# EasyEDA Pro project STC32F12K54_Motherboard_V1.epro

# Board PCB1
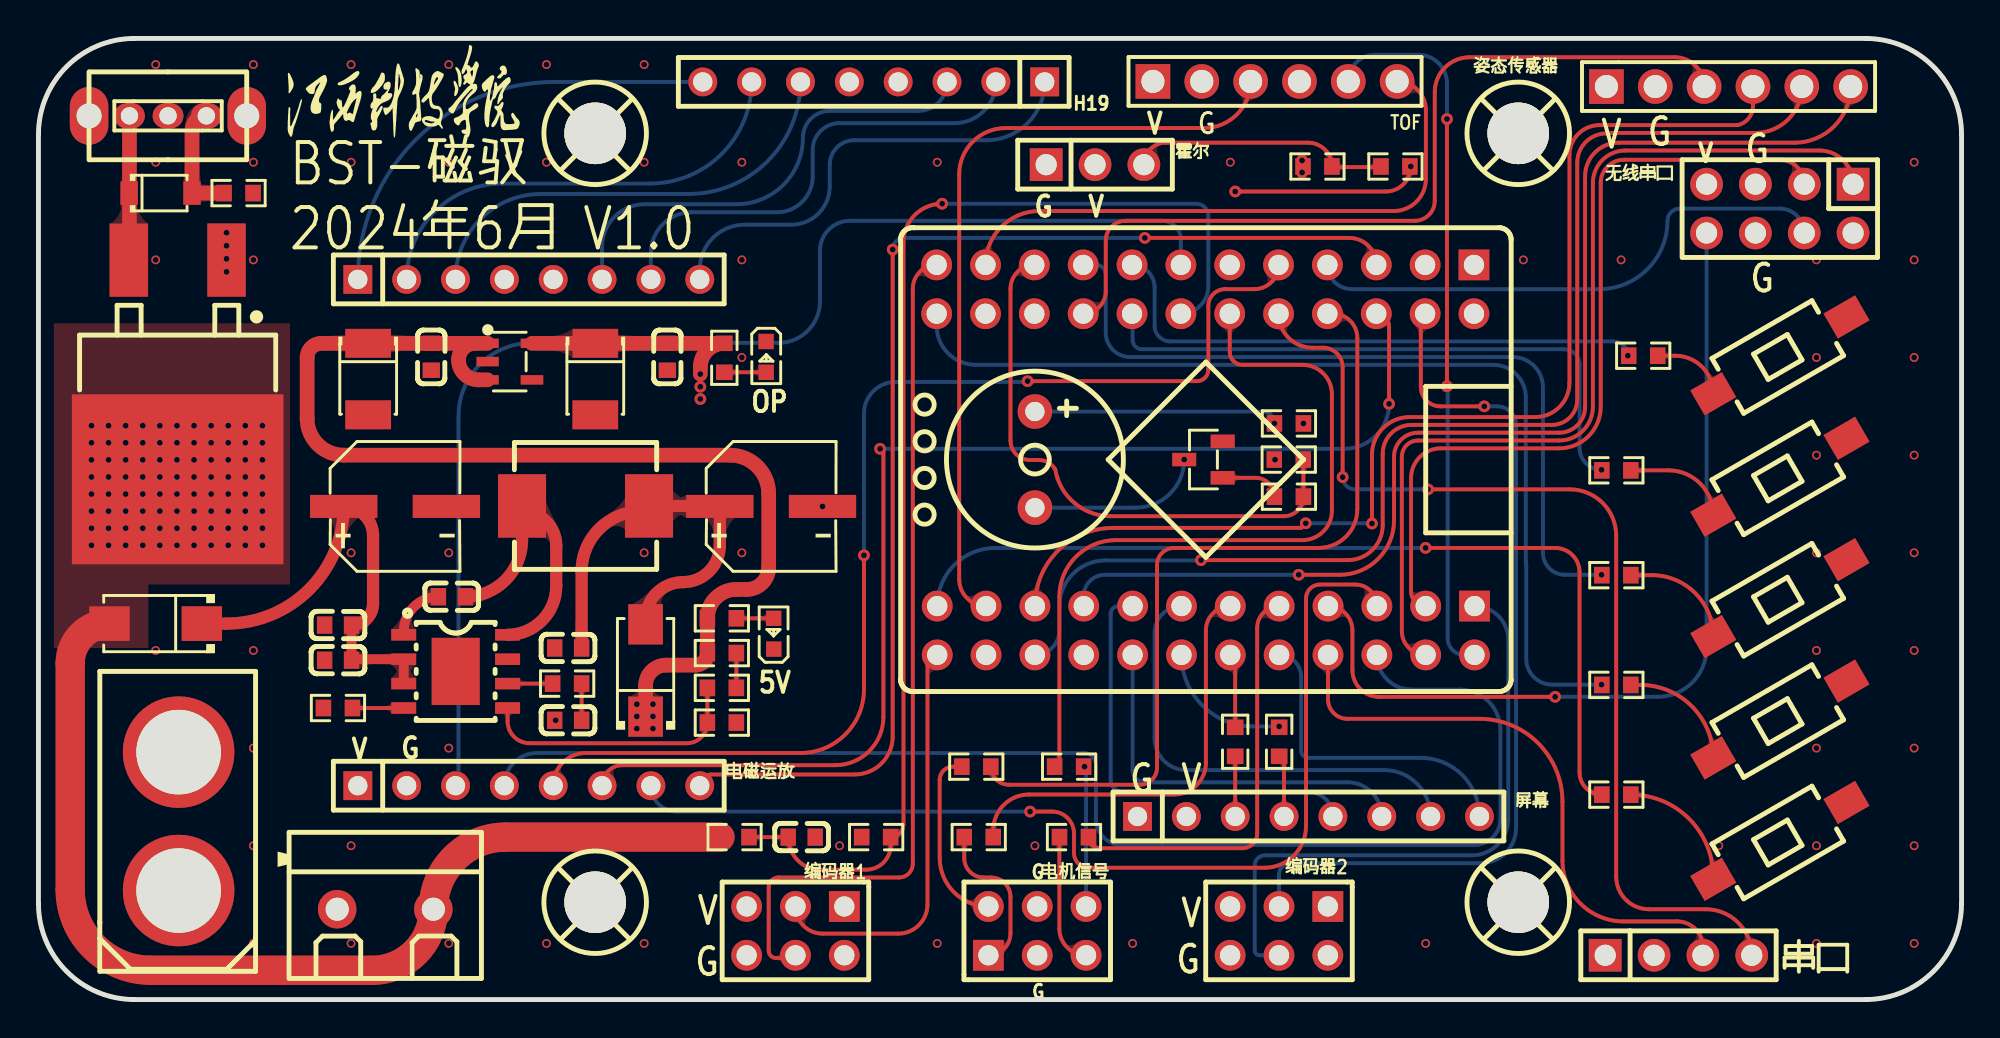
[diagram p0: board, top side]
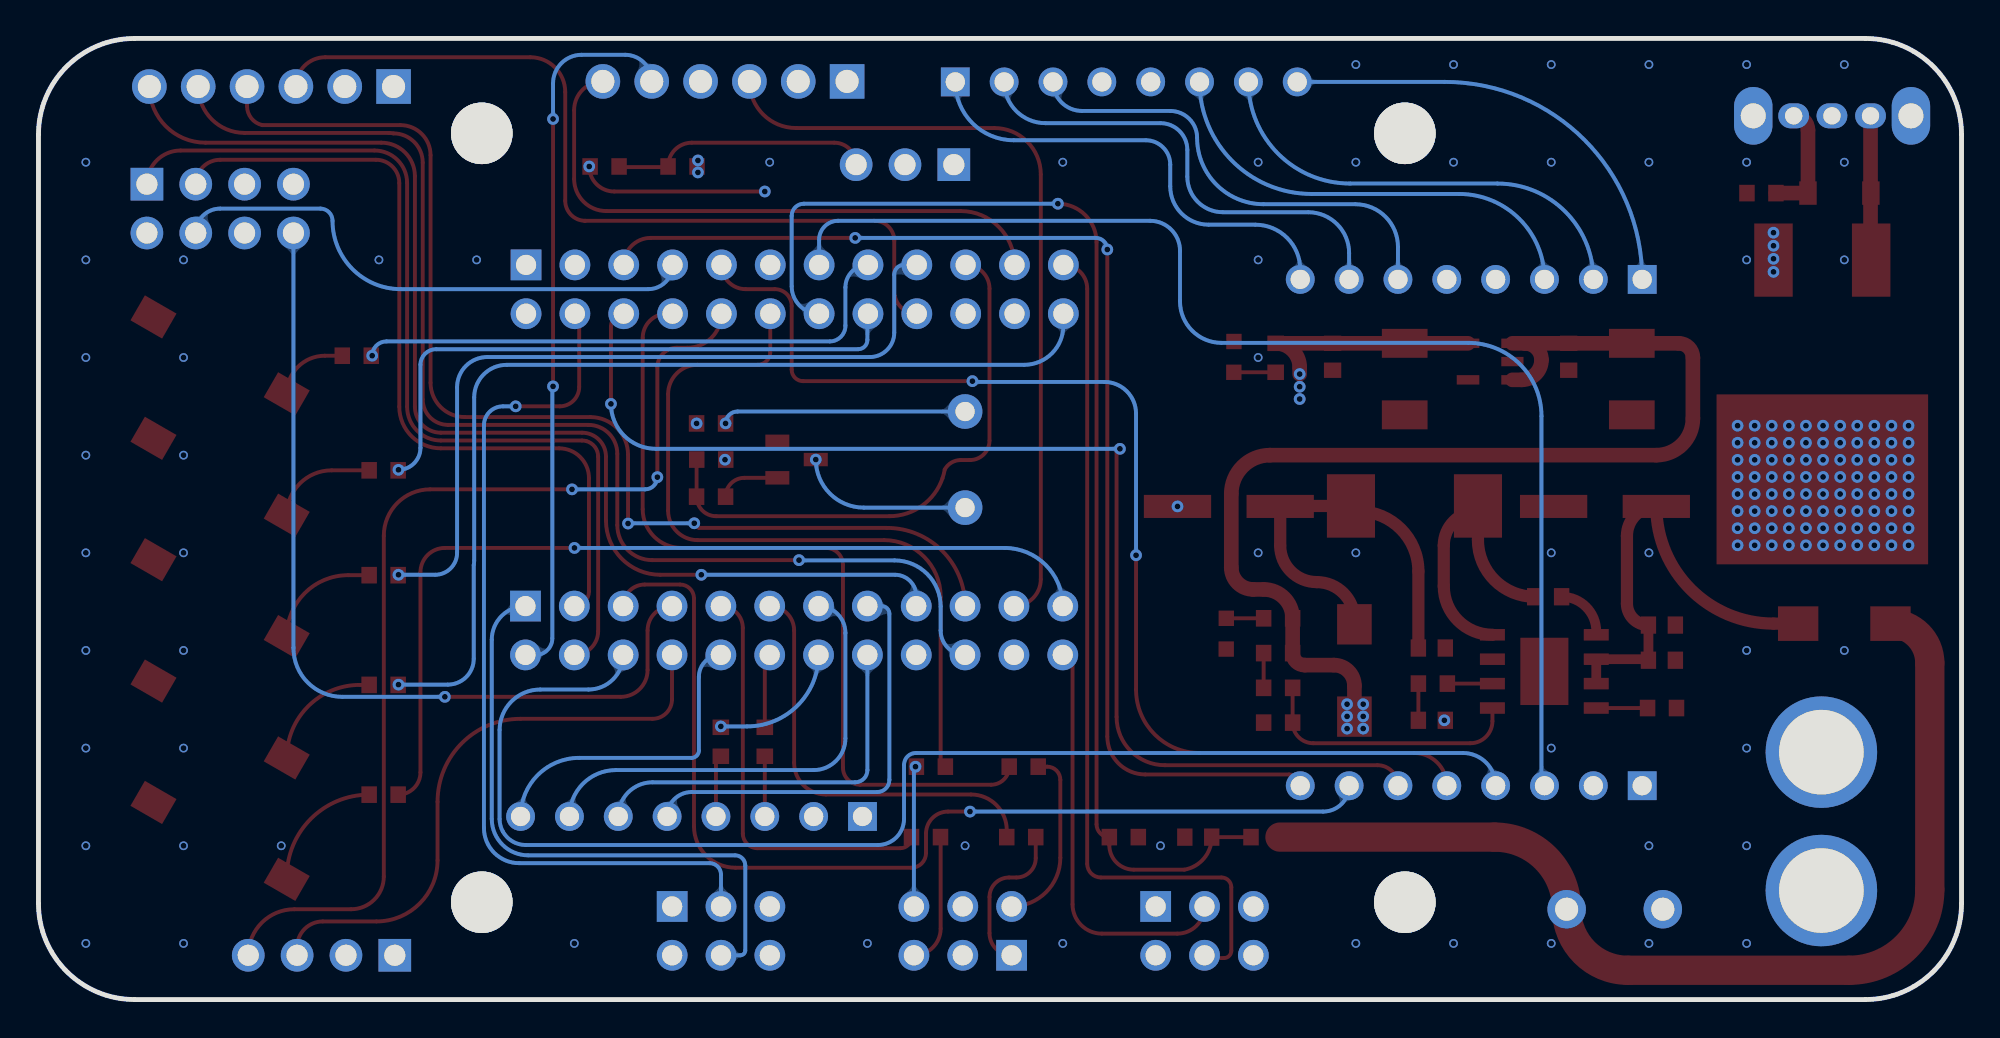
[diagram p1: board, bottom side, seen from below]

Outline 100 x 50 mm; copper layers: Top Layer, Inner1, Inner2, Bottom Layer. Coordinates in mm from the lower left corner of the outline.
Outline path: 0,45 0,5 arc(1.46,1.46) 5,0 95,0 arc(98.54,1.46) 100,5 100,45 arc(98.54,48.54) 95,50 5,50 arc(1.46,48.54) 0,45
Stack: Top Layer 0.035mm 外层铜厚1oz / Dielectric1 0.2104mm 7628 RC49% 8.6mil / Inner1 0.0152mm 内层铜厚 / Dielectric2 1.065mm 1.1mm H/HOZ 含铜 / Inner2 0.0152mm 内层铜厚 / Dielectric3 0.2104mm 7628 RC49% 8.6mil / Bottom Layer 0.035mm 外层铜厚1oz

## Design rules (mm)
template: 自定义配置
spacing copperThickness1oz (default): track to track 0.203, other pairs 0.152 to 0.3
spacing copperThickness2oz: track to track 0.203, other pairs 0.152 to 0.3
track width copperThickness1oz (default): min 0.127, default 0.203, max 2.54
track width copperThickness2oz: min 0.203, default 0.254, max 2.54
track width VCC5V: min 0.127, default 0.762, max 2.54
track width VCCBAT: min 0.127, default 1.524, max 2.54
differential pair differentialPair (default): width min 0.127, default 0.254, max 2.54; gap min 0.152, default 0.152
via viaSize (default): diameter min 0.457, default 0.457, max 10; hole min 0.3, default 0.305, max 6.299
net +5V uses VCC5V
net VCCBAT uses VCCBAT
net VCCOP uses VCC5V

## Placement (name value [footprint] x y rotation side)
BUZ1  蜂鸣器  [BUZ-TH_BD9.0-P5.00-D0.6-FD]  51.82 28.09 270 top
C9  4.7uF  [C0603]  15.58 19.48 0 top
C10  100nF  [C0603]  15.58 17.65 0 top
C11  100nF  [C0603]  21.5 20.95 0 top
C12  47uF  [C0603]  27.54 18.29 0 top
C14  4.7nF  [C0603]  27.54 14.53 0 top
C15  100nF  [C0603]  39.69 8.45 0 top
C17  100nF  [C0603]  20.43 33.44 90 top
C19  100nF  [C0603]  32.7 33.44 90 top
C20  100uF  [CASE-B_3528]  17.14 32.28 270 top
C21  100uF  [CASE-B_3528]  28.96 32.28 270 top
D2  BZT52C16  [sod-123_l2.7-w1.6-ls3.7-rd]  6.35 41.95 0 top
H6  -  [HDR-TH_4P-P2.54-V-M]  85.28 2.3 0 top
H9  -  [HDR-TH_6P-P2.54-V-R2-C3-S2.54_A2541WV-2X3P]  39.37 3.57 180 top
H10  -  [HDR-TH_6P-P2.54-V-R2-C3-S2.54_A2541WV-2X3P]  64.51 3.57 180 top
H11  -  [HDR-TH_8P-P2.54-V-M-R2-C4-S2.54]  90.55 41.15 180 top
H13  -  [HDR-TH_6P-P2.54-V-M-1]  64.3 47.76 0 top
H14  -  [HDR-TH_8P-P2.54-V-M]  66.04 9.53 0 top
H15  -  [HDR-TH_3P-P2.54-V-M]  54.94 43.43 0 top
H16  -  [HDR-TH_6P-P2.54-V-M-1]  87.88 47.5 0 top
H17  -  [HDR-TH_6P-P2.54-V-R2-C3-S2.54_A2541WV-2X3P]  51.94 3.57 0 top
H18  -  [HDR-TH_8P-P2.54-V-M]  25.5 11.13 0 top
H19  -  [HDR-TH_8P-P2.54-V-M]  43.43 47.74 180 top
H20  -  [HDR-TH_8P-P2.54-V-M]  25.5 37.47 0 top
LED4  -  [LED_0603]  37.85 33.38 270 top
LED5V  -  [LED_0603]  38.23 19.08 90 top
P1  KF301-2P接线端子  [CONN-TH_XY301V-A-5.0-2P]  18.03 4.7 180 top
Q2  HY19P03B  [TO-263-2_L10.2-W8.7-P5.08-LS15.1-BR]  7.24 32.77 90 top
Q3  SS8050  [SOT-23-3_L2.9-W1.3-P1.90-LS2.4-BR]  60.58 28.09 0 top
R1  10K  [R0603]  10.41 41.95 180 top
R8  200K  [R0603]  15.57 15.17 0 top
R9  51K  [R0603]  35.54 18.02 180 top
R10  1.5K  [R0603]  35.54 16.22 0 top
R11  10K  [R0603]  35.54 14.41 180 top
R12  4.7K  [R0603]  35.54 19.83 180 top
R13  20K  [R0603]  27.49 16.44 180 top
R15  200K  [R0603]  36.19 8.45 0 top
R16  20K  [R0603]  43.56 8.45 180 top
R17  100R  [R0603]  62.23 13.41 270 top
R18  100R  [R0603]  64.52 13.41 270 top
R19  100R  [R0603]  82.05 16.37 0 top
R20  100R  [R0603]  82.05 10.66 0 top
R21  100R  [R0603]  83.45 33.49 0 top
R22  100R  [R0603]  82.05 27.53 0 top
R23  100R  [R0603]  82.05 22.08 0 top
R24  10R  [R0603]  65.02 29.97 180 top
R25  4.7K  [R0603]  65.02 26.16 180 top
R26  10K  [R0603]  65.02 28.09 180 top
R31  10K  [R0603]  70.56 43.34 180 top
R32  10K  [R0603]  66.51 43.34 0 top
R33  10K  [R0603]  48.77 12.12 180 top
R34  10K  [R0603]  48.9 8.45 180 top
R35  10K  [R0603]  53.85 8.45 0 top
R36  10K  [R0603]  53.59 12.12 180 top
R37  2.7K  [R0603]  35.67 33.39 270 top
SCREW1  -  [M3螺丝]  29.01 5 0 top
SCREW2  -  [M3螺丝]  77.01 5 0 top
SCREW3  -  [M3螺丝]  29.01 45 0 top
SCREW4  -  [M3螺丝]  77.01 45 0 top
SW2  -  [SW-TH_SS-12D02-VG4]  6.73 45.97 180 top
SW3  TS-1096S-A2B3-C1D2  [SW-SMD_L6.0-W3.3-LS8.0]  90.55 14.57 30 top
SW4  TS-1096S-A2B3-C1D2  [SW-SMD_L6.0-W3.3-LS8.0]  90.55 8.25 30 top
SW5  TS-1096S-A2B3-C1D2  [SW-SMD_L6.0-W3.3-LS8.0]  90.55 33.51 30 top
SW6  TS-1096S-A2B3-C1D2  [SW-SMD_L6.0-W3.3-LS8.0]  90.55 27.2 30 top
SW7  TS-1096S-A2B3-C1D2  [SW-SMD_L6.0-W3.3-LS8.0]  90.55 20.88 30 top
U11  XT60  [CONN-TH_XT60]  7.29 9.27 90 top
U13  SP1N28STER  [ESOP-8_L4.9-W3.9-P1.27-LS6.0-TL-EP]  21.69 17.07 0 top
U14  -  [逐飞STC32F12-48P核心板]  60.71 28.09 270 top
U15  SS54  [SMA_L4.2-W2.6-LS5.1-RD]  6.1 19.56 180 top
U16  SS54  [SMA_L4.2-W2.6-LS5.1-RD]  31.57 17.12 90 top
U17  RT9013-18GB  [SOT-23-5_L3.0-W1.7-P0.95-LS2.8-BL]  24.51 33.19 270 top
U19  Inductor,47UH/功率电感  [IND-SMD_L7.4-W6.6]  28.45 25.68 0 top
U20  100uF贴片电解  [CAP-SMD_BD6.3-L6.6-W6.6-LS7.4-FD]  18.54 25.65 0 top
U21  100uF贴片电解  [CAP-SMD_BD6.3-L6.6-W6.6-LS7.4-FD]  38.1 25.65 0 top

## Footprints (pads in the part's own frame, mm; a bottom-side part is the same pattern mirrored in y, then rotated)
BUZ-TH_BD9.0-P5.00-D0.6-FD
  round 1.8 hole 1: 1(-2.5,0) 2(2.5,0)
C0603
  rect 0.8x0.9 smd: 1(-0.7,0) 2(0.7,0)
CAP-SMD_BD6.3-L6.6-W6.6-LS7.4-FD
  rect 3.5x1.2 smd: 1(-2.67,0) 2(2.67,0)
CASE-B_3528
  rect 1.506x2.376 smd: 1(-1.861,0) 2(1.861,0)
CONN-TH_XT60
  round 5.8 hole 4.4: 1(-3.6,0) 2(3.6,0)
CONN-TH_XY301V-A-5.0-2P
  round 2 hole 1.2: 1(-2.5,0) 2(2.5,0)
ESOP-8_L4.9-W3.9-P1.27-LS6.0-TL-EP
  rect 1.3x0.6 smd: 1(-2.7,1.905) 2(-2.7,0.635) 3(-2.7,-0.635) 4(-2.7,-1.905) 5(2.7,-1.905) 6(2.7,-0.635) 7(2.7,0.635) 8(2.7,1.905)
  rect 2.5x3.5 smd: 9(0,0)
HDR-TH_3P-P2.54-V-M
  rect 1.7x1.7 hole 1.1: 1(-2.54,0)
  round 1.7 hole 1.1: 2(0,0) 3(2.54,0)
HDR-TH_4P-P2.54-V-M
  rect 1.7x1.7 hole 1.1: 1(-3.81,0)
  round 1.7 hole 1.1: 2(-1.27,0) 3(1.27,0) 4(3.81,0)
HDR-TH_6P-P2.54-V-M-1
  rect 1.8x1.8 hole 1.2: 1(-6.35,0)
  round 1.8 hole 1.2: 2(-3.81,0) 3(-1.27,0) 4(1.27,0) 5(3.81,0) 6(6.35,0)
HDR-TH_6P-P2.54-V-R2-C3-S2.54_A2541WV-2X3P
  rect 1.6x1.6 hole 1.05: 1(-2.54,-1.27)
  round 1.6 hole 1.05: 2(-2.54,1.27) 3(0,-1.27) 4(0,1.27) 5(2.54,-1.27) 6(2.54,1.27)
HDR-TH_8P-P2.54-V-M
  rect 1.5x1.5 hole 1: 1(-8.89,0)
  round 1.5 hole 1: 2(-6.35,0) 3(-3.81,0) 4(-1.27,0) 5(1.27,0) 6(3.81,0) 7(6.35,0) 8(8.89,0)
HDR-TH_8P-P2.54-V-M-R2-C4-S2.54
  rect 1.7x1.7 hole 1.1: 1(-3.81,-1.27)
  round 1.7 hole 1.1: 2(-3.81,1.27) 3(-1.27,-1.27) 4(-1.27,1.27) 5(1.27,-1.27) 6(1.27,1.27) 7(3.81,-1.27) 8(3.81,1.27)
IND-SMD_L7.4-W6.6
  rect 2.5x3.3 smd: 1(-3.302,0) 2(3.302,0)
LED_0603
  rect 0.8x0.8 smd: 1(-0.851,-0.01) 2(0.75,-0.005)
M3螺丝
  round 3.2 hole 3.2: 1(-0.064,0.064)
R0603
  rect 0.806x0.864 smd: 1(-0.753,0) 2(0.753,0)
SMA_L4.2-W2.6-LS5.1-RD
  rect 2.1x1.8 smd: 1(-2.4,0) 2(2.4,0)
sod-123_l2.7-w1.6-ls3.7-rd
  rect 0.91x1.22 smd: 1(-1.635,0) 2(1.635,0)
SOT-23-3_L2.9-W1.3-P1.90-LS2.4-BR
  rect 1.25x0.7 smd: 1(1,-0.95) 2(1,0.95) 3(-1,0)
SOT-23-5_L3.0-W1.7-P0.95-LS2.8-BL
  rect 0.49x1.157 smd: 1(-0.95,-1.153) 2(0,-1.153) 3(0.95,-1.153)
  rect 0.49x1.175 smd: 4(0.95,1.153) 5(-0.95,1.153)
SW-SMD_L6.0-W3.3-LS8.0
  rect 1.9x1.5 smd: 1(-4,0) 2(4,0)
SW-TH_SS-12D02-VG4
  oval 1.6x1.3 hole 0.899: 1(-1.999,0) 2(-0.007,0) 3(1.999,0)
  oval 1.999x2.999 hole 1.3: 4(4.099,0) 5(-4.099,0)
TO-263-2_L10.2-W8.7-P5.08-LS15.1-BR
  rect 3.81x2 smd: 1(5.704,-2.54) 3(5.704,2.54)
  rect 8.84x11 smd: 4(-5.704,0)
逐飞STC32F12-48P核心板
  rect 1.6x1.6 hole 1.05: 1(-10.13,13.94) 47(7.62,13.97)
  round 1.6 hole 1.05: 2(-7.59,13.94) 3(-10.13,11.4) 4(-7.59,11.4) 5(-10.13,8.86) 6(-7.59,8.86) 7(-10.13,6.32) 8(-7.59,6.32) 9(-10.13,3.78) 10(-7.59,3.78) 11(-10.13,1.24) 12(-7.59,1.24) 13(-10.13,-1.3) 14(-7.59,-1.3) 15(-10.13,-3.84) 16(-7.59,-3.84) 17(-10.13,-6.38) 18(-7.59,-6.38) 19(-10.13,-8.92) 20(-7.59,-8.92) 21(-10.13,-11.46) 22(-7.59,-11.46) 23(-10.13,-14) 24(-7.59,-14) 25(7.62,-13.97) 26(10.16,-13.97) 27(7.62,-11.43) 28(10.16,-11.43) 29(7.62,-8.89) 30(10.16,-8.89) 31(7.62,-6.35) 32(10.16,-6.35) 33(7.62,-3.81) 34(10.16,-3.81) 35(7.62,-1.27) 36(10.16,-1.27) 37(7.62,1.27) 38(10.16,1.27) 39(7.62,3.81) 40(10.16,3.81) 41(7.62,6.35) 42(10.16,6.35) 43(7.62,8.89) 44(10.16,8.89) 45(7.62,11.43) 46(10.16,11.43) 48(10.16,13.97)

## Nets
+5V: C17.2 C20.1 H6.1 H9.5 H10.5 H11.7 H13.1 H14.2 H15.2 H16.1 R9.2 R12.2 R24.1 R32.1 U14.2 U14.11 U16.1 U17.1 U17.3
GND5V: C17.1 C19.1 C20.2 C21.2 H6.2 H9.6 H10.6 H11.5 H11.6 H13.2 H14.1 H15.1 H16.2 H18.2 H19.4 H19.5 H20.4 H20.5 LED4.1 Q3.2 R26.2 SW3.2 SW4.2 SW5.2 SW6.2 SW7.2 U14.1 U14.3 U17.2
GNDBAT: C9.1 C10.1 C12.1 C14.1 C15.2 H17.3 H17.4 LED5V.1 P1.2 R1.1 R8.1 R11.1 R16.2 U11.1 U13.7 U13.9 U20.2 U21.2
VCCBAT: P1.1 Q2.4 R15.1 U15.2
VCCOP: C19.2 C21.1 H18.1 R37.1 U17.5
0.0: H18.7 U14.43
0.1: H18.4 U14.44
0.2: H11.3 U14.45
0.3: H11.1 U14.46
0.4: H10.4 U14.47
0.5: H18.8 U14.5
0.6: H18.6 U14.6
0.7: H11.4 U14.7
1.0: R33.1 U14.8
1.1: H18.5 U14.9
1.3: R36.2 U14.12
1.4: H18.3 U14.13
1.5: C15.1 R15.2 R16.1 U14.14
1.6: R21.1 U14.15
1.7: R22.1 U14.16
2.0: H14.5 U14.33
2.1: H14.6 U14.34
2.2: H14.7 U14.35
2.3: R18.1 U14.36
2.4: R34.1 U14.37
2.5: R17.1 U14.38
2.6: R35.2 U14.39
2.7: H14.8 U14.40
3.0: R25.1 R26.1 U14.19
3.2: H13.6 U14.21
3.3: U14.22
3.4: H9.4 U14.23
3.5: H9.3 U14.26
3.6: H13.3 U14.27
3.7: H13.4 U14.28
4.0: H16.3 U14.18
4.1: H16.4 U14.29
4.2: H16.5 U14.30
4.3: H16.6 U14.31
4.4: R31.1 U14.32
4.5: H11.8 U14.41
4.6: H6.3 U14.42
4.7: H6.4 U14.10
5.0: R19.1 U14.24
5.1: R20.1 U14.25
5.2: H13.5 U14.48
5.3: H10.3 U14.4
RST: R23.1 U14.17
$2N862: Q2.1 SW2.2
$2N864: D2.2 R1.2 SW2.1
$2N865: D2.1 Q2.3 SW2.3 U11.2
$2N1375: C9.2 C10.2 U13.2 U13.3 U15.1 U20.1
$2N1376: R8.2 U13.4
$2N1377: C11.1 U13.1
$2N1378: C11.2 U13.8 U19.1
$2N1382: LED5V.2 R12.1
$2N1383: C14.2 R13.1
$2N2286: H14.3 R17.2
$2N2312: H14.4 R18.2
$2N4201: R22.2 SW6.1
$2N4204: R21.2 SW5.1
$2N4207: R20.2 SW4.1
$2N4210: R19.2 SW3.1
$2N4330: R23.2 SW7.1
$2N4637: BUZ1.1 R24.2
$2N4791: H15.3 R31.2 R32.2
$2N5169: H17.2 R33.2
$2N5175: H17.6 R36.1
$2N5181: H17.5 R35.1
$2N5187: H17.1 R34.2
$2N5421: Q3.1 R25.2
$2N14767: R9.1 R10.2
$2N14896: C12.2 U16.2 U19.2 U21.1
$2N15019: R13.2 U13.6
$2N15192: R10.1 R11.2 U13.5
$2N20242: LED4.2 R37.2
$2N23857: BUZ1.2 Q3.3
$2N28219: H19.1 H20.8
$2N28229: H19.2 H20.7
$2N28234: H19.3 H20.6
$2N28247: H19.6 H20.3
$2N28264: H19.7 H20.2
$2N28269: H19.8 H20.1

Pads without a net: H9 1 2; H10 1 2; H11 2; SCREW1 1; SCREW2 1; SCREW3 1; SCREW4 1; SW2 4 5; U14 20; U17 4

## Via types
v1: diameter 0.61, hole 0.305, Top Layer to Bottom Layer, 136 vias
v2: diameter 0.457, hole 0.305, Top Layer to Bottom Layer, 59 vias

## Routing (per net, layer and track width the routed paths; a pad name or vN(x,y) marks a point on that pad's centre or on a via; arc(x,y) is an arc through that point)
+5V: length 58.8
  Top Layer w0.762: 22.71,34.14 C17.2 14.71,34.14 arc(14.19,33.92) 13.97,33.4 13.97,30.23 arc(14.53,28.88) 15.88,28.32 35.96,28.32 arc(37.38,27.73) 37.97,26.31 37.97,22.48 arc(37.64,21.67) 36.83,21.34 36.29,21.34 arc(35.22,20.9) R12.2 R9.2 arc(34.6,17.58) 34.16,17.4 32.64,17.4 arc(31.88,17.09) 31.57,16.33 U16.1 ; 22.71,34.14 U17.1 ; 22.71,34.14 arc(22.1,33.89) 21.84,33.27 arc(22.15,32.54) 22.88,32.24 U17.3
  vias: v1(31.12,15.37) v1(31.12,14.73) v1(31.12,14.1) v1(31.95,15.37) v1(31.95,14.73) v1(31.95,14.1) v1(65.71,43.65) v1(65.71,43.03) v1(65.78,29.97)
GND5V:
  vias: v1(64.3,28.08)
GNDBAT:
  vias: v1(26.89,14.53) v1(40.77,25.65) v2(6.1,48.64) v2(6.1,43.56) v2(6.1,38.48) v2(6.1,18.16) v2(11.18,48.64) v2(11.18,43.56) v2(11.18,38.48) v2(11.18,18.16) v2(11.18,13.08) v2(11.18,8) v2(11.18,2.92) v2(16.26,48.64) v2(16.26,43.56) v2(16.26,23.24) v2(16.26,8) v2(16.26,2.92) v2(21.34,48.64) v2(21.34,43.56) v2(21.34,23.24) v2(21.34,13.08) v2(21.34,2.92) v2(26.42,48.64) v2(26.42,43.56) v2(26.42,2.92) v2(31.5,48.64) v2(31.5,43.56) v2(31.5,23.24) v2(31.5,2.92) v2(36.58,43.56) v2(36.58,38.48) v2(36.58,33.4) v2(36.58,23.24) v2(41.66,8) v2(46.74,43.56) v2(46.74,2.92) v2(51.82,8) v2(56.9,2.92) v2(61.98,43.56) v2(72.14,2.92) v2(77.22,38.48) v2(82.3,38.48) v2(87.38,8) v2(92.46,38.48) v2(92.46,33.4) v2(92.46,28.32) v2(92.46,23.24) v2(92.46,18.16) v2(92.46,13.08) v2(92.46,8) v2(92.46,2.92) v2(97.54,43.56) v2(97.54,38.48) v2(97.54,33.4) v2(97.54,28.32) v2(97.54,23.24) v2(97.54,18.16) v2(97.54,13.08) v2(97.54,8) v2(97.54,2.92)
VCCBAT: length 55.1
  Top Layer w1.524: R15.1 24.29,8.45 arc(21.63,7.35) P1.1 arc(19.6,2.45) 17.36,1.52 5.84,1.52 arc(2.88,2.75) 1.65,5.72 1.65,17.51 arc(2.25,18.96) U15.2
  vias: v1(2.76,29.86) v1(2.76,28.97) v1(2.76,28.08) v1(2.76,27.19) v1(2.76,26.3) v1(2.76,25.41) v1(2.76,24.52) v1(2.76,23.63) v1(3.64,29.86) v1(3.64,28.97) v1(3.64,28.08) v1(3.64,27.19) v1(3.64,26.3) v1(3.64,25.41) v1(3.64,24.52) v1(3.64,23.63) v1(4.53,29.86) v1(4.53,28.97) v1(4.53,28.08) v1(4.53,27.19) v1(4.53,26.3) v1(4.53,25.41) v1(4.53,24.52) v1(4.53,23.63) v1(5.42,29.86) v1(5.42,28.97) v1(5.42,28.08) v1(5.42,27.19) v1(5.42,26.3) v1(5.42,25.41) v1(5.42,24.52) v1(5.42,23.63) v1(6.31,29.86) v1(6.31,28.97) v1(6.31,28.08) v1(6.31,27.19) v1(6.31,26.3) v1(6.31,25.41) v1(6.31,24.52) v1(6.31,23.63) v1(7.2,29.86) v1(7.2,28.97) v1(7.2,28.08) v1(7.2,27.19) v1(7.2,26.3) v1(7.2,25.41) v1(7.2,24.52) v1(7.2,23.63) v1(8.09,29.86) v1(8.09,28.97) v1(8.09,28.08) v1(8.09,27.19) v1(8.09,26.3) v1(8.09,25.41) v1(8.09,24.52) v1(8.09,23.63) v1(8.98,29.86) v1(8.98,28.97) v1(8.98,28.08) v1(8.98,27.19) v1(8.98,26.3) v1(8.98,25.41) v1(8.98,24.52) v1(8.98,23.63) v1(9.87,29.86) v1(9.87,28.97) v1(9.87,28.08) v1(9.87,27.19) v1(9.87,26.3) v1(9.87,25.41) v1(9.87,24.52) v1(9.87,23.63) v1(10.76,29.86) v1(10.76,28.97) v1(10.76,28.08) v1(10.76,27.19) v1(10.76,26.3) v1(10.76,25.41) v1(10.76,24.52) v1(10.76,23.63) v1(11.65,29.86) v1(11.65,28.97) v1(11.65,28.08) v1(11.65,27.19) v1(11.65,26.3) v1(11.65,25.41) v1(11.65,24.52) v1(11.65,23.63)
VCCOP: length 46.7
  Top Layer w0.762: 25.66,34.14 C21.1 C19.2 35.28,34.14 ; v1(34.42,32.54) 34.42,32.89 arc(34.78,33.77) R37.1
  Inner1 w0.762: v1(34.42,32.54) v1(34.42,31.88) v1(34.42,31.24) 34.42,30.24 arc(34,29.24) 33.01,28.83 25.53,28.83 arc(19.22,26.22) 16.61,19.91 H18.1
0.0: length 54.8
  Top Layer w0.203: v1(51.56,9.78) 52.71,9.78 arc(53.51,9.44) 53.85,8.64 53.85,7.62 arc(54.07,7.08) 54.61,6.86 63.75,6.86 arc(65.28,7.49) 65.91,9.02 65.91,20.87 arc(66.12,21.38) 66.63,21.59 68.48,21.59 arc(69.27,21.26) U14.43
  Bottom Layer w0.203: v1(51.56,9.78) 33.19,9.78 arc(32.24,10.17) H18.7
0.1: length 70.8
  Bottom Layer w0.203: U14.44 arc(70.12,16.66) 71.4,16.13 73.91,16.13 arc(75.4,15.51) 76.02,14.01 76.02,9.4 arc(75.98,9.06) 75.86,8.75 arc(75.36,8.23) 74.66,8.04 56.35,8.04 arc(55.39,8.44) 54.99,9.4 54.99,12.21 arc(54.8,12.65) 54.36,12.83 25.93,12.83 arc(24.72,12.33) H18.4
0.2: length 42.7
  Top Layer w0.203: H11.3 arc(91.45,43.32) 90.55,43.69 82.45,43.69 arc(81.59,43.33) 81.24,42.48 81.24,30.84 arc(80.6,29.31) 79.07,28.68 72.93,28.68 arc(71.83,28.22) 71.37,27.12 71.37,21.23 arc(71.6,20.69) U14.45
0.3: length 49.6
  Top Layer w0.203: H11.1 arc(93.85,43.66) 92.61,44.17 82.52,44.17 arc(81.33,43.67) 80.83,42.48 80.83,30.84 arc(80.32,29.6) 79.07,29.08 71.73,29.08 arc(71.62,29.08) 71.51,29.05 arc(71.07,28.75) 70.9,28.25 70.9,19.17 arc(71.26,18.29) U14.46
0.4: length 32.5
  Bottom Layer w0.203: H10.4 63.5,2.3 arc(63.32,2.38) 63.25,2.56 63.25,6.97 arc(63.4,7.35) 63.77,7.5 74.53,7.5 arc(75.87,8.06) 76.43,9.4 76.43,18.72 arc(75.92,19.96) U14.47
0.5: length 63.1
  Top Layer w0.203: v1(44.42,39.02) 44.42,13.69 ; v1(57.53,39.62) 68.16,39.62 arc(69.15,39.21) U14.5 ; 44.42,13.69 arc(43.84,12.29) 42.44,11.71 34.97,11.71 arc(34.56,11.54) H18.8
  Bottom Layer w0.203: v1(57.53,39.62) 45.03,39.62 arc(44.6,39.45) v1(44.42,39.02)
0.6: length 63.6
  Top Layer w0.203: v1(70.23,30.99) 70.23,35.01 arc(70.04,35.48) U14.6 ; v1(43.76,28.65) arc(43.89,28.6) 43.94,28.48 43.94,14.7 arc(43.2,12.93) 41.43,12.19 30.37,12.19 arc(29.62,11.88) H18.6
  Bottom Layer w0.203: v1(43.76,28.65) 67.89,28.65 arc(69.55,29.34) v1(70.23,30.99)
0.7: length 28.6
  Bottom Layer w0.203: H11.4 arc(91.45,40.78) 90.55,41.15 85.34,41.15 arc(84.89,40.96) 84.71,40.51 arc(83.67,38) 81.15,36.96 68.29,36.96 arc(67.4,37.33) U14.7
1.0: length 43.5
  Top Layer w0.203: U14.8 67.32,35.68 arc(68.21,35.31) 68.58,34.42 68.58,25.51 arc(67.99,24.09) 66.56,23.5 59.06,23.5 arc(58.43,23.23) 58.17,22.61 58.17,12.06 arc(57.91,11.44) 57.28,11.18 50.46,11.18 arc(49.8,11.45) R33.1
1.1: length 60.8
  Top Layer w0.203: v1(51.44,32.17) 60.24,32.17 arc(60.66,32.35) 60.83,32.77 60.83,36.08 arc(61.09,36.7) 61.71,36.96 63.22,36.96 arc(64.12,37.33) U14.9 ; v1(42.93,23.11) 42.93,16.13 arc(41.96,13.79) 39.62,12.83 28.47,12.83 arc(27.26,12.33) H18.5
  Bottom Layer w0.203: v1(42.93,23.11) 42.93,30.48 arc(43.41,31.65) 44.58,32.13 51.39,32.13 arc(51.42,32.14) v1(51.44,32.17)
1.3: length 40.3
  Top Layer w0.203: U14.12 61.95,33.69 arc(62.14,33.21) 62.61,33.02 65.73,33.02 arc(66.81,32.57) 67.26,31.49 67.26,25.43 arc(66.81,24.35) 65.73,23.9 56.03,23.9 arc(53.95,23.04) 53.09,20.95 53.09,12.36 arc(53.01,12.19) R36.2
1.4: length 65.7
  Bottom Layer w0.203: U14.13 59.41,39.53 arc(59.12,40.22) 58.42,40.51 42.2,40.51 arc(41.1,40.06) 40.64,38.95 40.64,36.32 arc(40.01,34.8) 38.48,34.16 25.65,34.16 arc(22.96,33.05) 21.84,30.35 21.84,11.28 arc(21.8,11.17) H18.3
1.5: length 64.1
  Top Layer w0.203: R15.2 arc(36.95,8.45) 36.95,8.45 C15.1 arc(39.39,7.34) 40.41,6.76 43.04,6.76 arc(43.94,7.13) 44.31,8.03 R16.1 arc(44.78,8.65) 44.98,9.12 44.98,39.39 arc(45.57,40.81) v1(46.99,41.4)
  Bottom Layer w0.203: v1(46.99,41.4) 60.2,41.4 arc(60.65,41.22) 60.83,40.77 60.83,37.11 arc(60.42,36.1) U14.14
1.6: length 29.3
  Bottom Layer w0.203: v1(82.65,33.49) arc(82.43,34.02) 81.9,34.24 58.85,34.24 arc(58.28,34.48) 58.04,35.05 58.04,37.05 arc(57.7,37.88) U14.15
1.7: length 31.5
  Bottom Layer w0.203: U14.16 arc(56.89,35.67) 56.9,35.65 56.9,34.31 arc(57.04,33.97) 57.38,33.83 79.32,33.83 arc(79.9,33.59) 80.14,33.02 80.14,28.7 arc(80.47,27.89) v1(81.28,27.56)
2.0: length 22.7
  Bottom Layer w0.203: U14.33 56.16,20.47 arc(55.87,20.35) 55.75,20.07 55.75,11.43 arc(55.94,10.98) 56.39,10.8 66.04,10.8 arc(66.94,10.42) H14.5
2.1: length 20.3
  Bottom Layer w0.203: U14.34 56.9,11.94 arc(57.08,11.49) 57.53,11.3 68.07,11.3 arc(69.33,10.78) H14.6
2.2: length 24.3
  Bottom Layer w0.203: H14.7 arc(71.68,11.23) 69.98,11.94 59.69,11.94 arc(58.52,12.42) 58.04,13.59 58.04,19.07 arc(58.45,20.06) U14.35
2.3: length 7.2
  Bottom Layer w0.203: v1(64.52,14.21) 63.16,14.21 arc(60.53,15.3) U14.36
2.4: length 22.3
  Top Layer w0.203: R34.1 49.65,8.81 arc(50.19,10.12) 51.51,10.67 59.06,10.67 arc(60.22,11.15) 60.71,12.32 60.71,19.2 arc(61.08,20.1) U14.37
2.5: length 3.9
  Top Layer w0.203: R17.1 62.23,17.68 arc(62.16,17.86) U14.38
2.6: length 22
  Top Layer w0.203: U14.39 arc(63.71,20.13) 63.37,19.33 63.37,8.64 arc(63.15,8.1) 62.61,7.87 55.18,7.87 arc(54.77,8.04) R35.2
2.7: length 16.9
  Bottom Layer w0.203: H14.8 arc(74.04,11.68) 71.88,12.57 66.04,12.57 arc(65.77,12.68) 65.66,12.95 65.66,16.79 arc(65.32,17.59) U14.40
3.0: length 29.6
  Top Layer w0.203: R26.1 arc(65.77,28.09) 65.78,28.08 R25.1 arc(65.48,25.44) 64.76,25.15 55.75,25.15 arc(54.06,25.69) 52.99,27.12 arc(52.92,27.34) 52.87,27.57 arc(52.53,27.93) 52.04,28.07 51.56,28.07 arc(50.84,28.36) 50.55,29.08 50.55,36.98 arc(50.91,37.86) U14.19
3.2: length 31.4
  Top Layer w0.203: U14.21 arc(50.07,40.2) 52.05,41.02 70.47,41.02 arc(71.66,41.51) 72.15,42.69 72.15,46.27 arc(71.71,47.33) H13.6
3.4: length 45
  Top Layer w0.203: U14.23 arc(45.83,37.86) 45.47,36.98 45.47,7.06 arc(45.26,6.56) 44.75,6.35 38.48,6.35 arc(38.12,6.2) 37.97,5.84 37.97,2.54 arc(38.08,2.27) 38.35,2.16 39.22,2.16 arc(39.32,2.2) H9.4
3.5: length 21.8
  Top Layer w0.203: U14.26 arc(46.38,17.78) 46.23,17.42 46.23,4.95 arc(45.78,3.88) 44.7,3.43 40.78,3.43 arc(39.78,3.84) 39.37,4.84
3.6: length 41.2
  Top Layer w0.203: H13.3 arc(62.32,46.05) 60.61,45.34 50.29,45.34 arc(48.59,44.63) 47.88,42.93 47.88,21.87 arc(48.29,20.88) U14.27
3.7: length 43
  Inner1 w0.203: U14.28 49.43,17.93 arc(50.13,18.22) 50.42,18.92 50.42,21.59 arc(50.79,22.49) 51.69,22.86 51.72,22.86 arc(52.69,23.26) 53.09,24.22 53.09,39.5 arc(53.2,39.77) 53.47,39.88 arc(53.68,39.97) 53.77,40.18 53.77,44.54 arc(54.16,45.46) 55.08,45.85 64.01,45.85 arc(64.4,45.9) 64.77,46.05 arc(65.36,46.62) 65.57,47.41 H13.4
4.0: length 44.3
  Top Layer w0.203: U14.18 arc(55.16,36.02) 55.5,36.85 55.5,39.48 arc(55.8,40.21) 56.53,40.51 71.56,40.51 arc(71.59,40.51) 71.61,40.51 arc(72.32,40.83) 72.61,41.56 72.61,47.21 arc(73.14,48.49) 74.42,49.02 85.09,49.02 arc(86.17,48.58) H16.3
4.1: length 59.8
  Top Layer w0.203: v1(65.9,24.78) 65.66,24.54 55.88,24.54 arc(53.01,23.35) U14.29 ; v1(69.34,24.77) 69.34,28.34 arc(69.92,29.73) 71.3,30.3 77.83,30.3 arc(79.09,30.83) 79.61,32.09 79.61,43.92 arc(80.07,45.03) 81.18,45.49 88.36,45.49 arc(88.93,45.85) 89.15,46.48 H16.4
  Bottom Layer w0.203: v1(65.9,24.78) 69.33,24.78 arc(69.34,24.77) v1(69.34,24.77)
4.2: length 64.2
  Top Layer w0.203: v1(60.45,22.86) 68.08,22.86 arc(69.37,23.39) 69.9,24.68 69.9,28.39 arc(70.34,29.46) 71.4,29.9 78.7,29.9 arc(79.63,30.28) 80.02,31.22 80.02,43.54 arc(80.46,44.61) 81.54,45.06 arc(81.66,45.08) 81.79,45.08 89.28,45.08 arc(90.99,45.79) H16.5
  Bottom Layer w0.203: 60.47,22.85 55.48,22.85 arc(53.79,22.14) 53.09,20.45 53.09,19.2 arc(52.71,18.3) U14.30
4.3: length 62.1
  Top Layer w0.203: v1(65.53,22.1) 67.67,22.1 arc(69.66,22.93) 70.49,24.92 70.49,28.25 arc(70.85,29.13) 71.73,29.49 79.07,29.49 arc(80.03,29.89) 80.42,30.84 80.42,42.83 arc(80.94,44.07) 82.17,44.58 91.31,44.58 arc(93.38,45.43) H16.6
  Bottom Layer w0.203: v1(65.53,22.1) 55.46,22.1 arc(54.68,21.78) 54.36,21 U14.31
4.4: length 50
  Top Layer w0.203: v1(62.23,42.04) 70.06,42.04 arc(70.98,42.42) v1(71.36,43.34)
  Inner1 w0.203: U14.32 arc(55.16,18.26) 55.5,19.07 55.5,39.18 arc(55.96,40.3) 57.09,40.77 68.79,40.77 arc(70.61,41.52) v1(71.36,43.34)
4.5: length 46.3
  Top Layer w0.203: v1(78.87,15.75) 69.72,15.75 arc(68.74,16.16) 68.33,17.14 68.33,19.2 arc(67.95,20.1) U14.41
  Bottom Layer w0.203: H11.8 86.74,18.29 arc(86,16.49) 84.2,15.75 v1(78.87,15.75)
4.6: length 30.9
  Top Layer w0.203: U14.42 67.06,15.62 arc(67.35,14.9) 68.07,14.61 74.93,14.61 arc(77.98,13.34) 79.25,10.29 79.25,7.24 arc(80.18,4.99) 82.42,4.06 85.22,4.06 arc(86.16,3.67) 86.55,2.73 H6.3
4.7: length 53.7
  Top Layer w0.203: v1(67.82,27.18) 67.82,32.89 arc(67.52,33.61) 66.8,33.91 66.26,33.91 arc(65,34.43) U14.10 ; v1(72.26,26.54) 79.63,26.54 arc(81.34,25.84) 82.04,24.13 82.04,6.4 arc(82.54,5.2) 83.74,4.7 86.69,4.7 arc(88.39,4) H6.4
  Bottom Layer w0.203: v1(72.26,26.54) 68.45,26.54 arc(68,26.73) v1(67.82,27.18)
5.0: length 51.7
  Bottom Layer w0.203: v1(81.28,16.38) 78.71,16.38 arc(77.76,16.78) 77.37,17.73 77.37,22.61 arc(77.35,22.73) 77.34,22.84 77.34,31.33 arc(76.85,32.52) 75.65,33.02 48.74,33.02 arc(47.3,33.62) 46.71,35.06 U14.24 arc(46.73,35.67) 46.74,35.65
5.1: length 48.1
  Top Layer w0.203: v1(72.13,23.5) 78.87,23.5 arc(79.77,23.12) 80.14,22.22 80.14,11.82 arc(80.48,11) R20.1
  Bottom Layer w0.203: v1(72.13,23.5) 49.76,23.5 arc(47.62,22.61) U14.25
5.2: length 37.5
  Top Layer w0.203: v1(73.24,31.9) v1(73.24,45.81)
  Bottom Layer w0.203: U14.48 74.15,17.93 arc(73.53,18.18) 73.28,18.8 73.28,31.88 ; v1(73.24,45.81) 73.24,47.66 arc(72.81,48.71) 71.75,49.15 69.5,49.15 arc(68.52,48.74) H13.5
5.3: length 46.3
  Top Layer w0.203: v1(75.18,30.86) 72.9,30.86 arc(72.18,31.16) 71.88,31.88 71.88,35.46 arc(71.95,35.61) U14.4
  Bottom Layer w0.203: 64.51,4.84 64.51,6.5 arc(64.68,6.92) 65.1,7.1 75.01,7.1 arc(76.3,7.63) 76.84,8.93 76.84,29.87 arc(76.55,30.57) 75.85,30.86 v1(75.18,30.86)
RST: length 41.3
  Bottom Layer w0.203: 81.41,22.1 79.38,22.1 arc(78.57,22.43) 78.23,23.24 78.23,31.85 arc(77.77,32.97) 76.66,33.43 56.77,33.43 arc(55.87,33.8) 55.5,34.7 55.5,37.72 arc(55.35,38.07) 55,38.22 U14.17
  vias: v1(81.28,22.1)
$2N862:
  vias: v1(9.78,39.89) v1(9.78,39.22) v1(9.78,38.54) v1(9.78,37.86)
$2N864: length 6.1
  Top Layer w0.762: R1.2 D2.2 7.98,45.23 arc(8.2,45.76) SW2.1
$2N865: length 46.3
  Top Layer w0.762: SW2.3 4.73,38.5 arc(4.72,38.48) Q2.3
  Inner1 w1.524: SW2.3 4.73,42.45 arc(4.31,41.44) 3.3,41.02 arc(1.72,40.36) 1.06,38.78 1.06,19.1 arc(2.89,14.69) U11.2
$2N1375: length 24.4
  Top Layer w0.508: U13.3 U13.2 16.33,17.71 arc(16.3,17.69) C10.2 C9.2
  Top Layer w0.635: U15.1 9.78,19.56 arc(14.09,21.34) U20.1 arc(16.95,25.21) 17.4,24.13 17.4,20.6 arc(17.07,19.81) C9.2
$2N1376: length 2.7
  Top Layer w0.203: U13.4 R8.2
$2N1377: length 3
  Top Layer w0.508: U13.1 18.99,19.15 arc(19.52,20.43) C11.1
$2N1378: length 15.2
  Top Layer w0.203: C11.2 22.42,20.95
  Top Layer w0.635: U13.8 arc(26.18,19.72) 26.92,21.51 26.92,23.62 arc(26.4,24.88) 25.15,25.4 25.15,23.9 arc(24.28,21.82) C11.2
$2N1382: length 1.8
  Top Layer w0.203: R12.1 38.1,19.83
$2N1383: length 1.9
  Top Layer w0.203: R13.1 C14.2
$2N2286: length 3.1
  Top Layer w0.203: H14.3 R17.2
$2N2312: length 3.3
  Top Layer w0.203: H14.4 64.77,12.4 arc(64.7,12.58) R18.2
$2N4201: length 5.6
  Top Layer w0.203: R22.2 84.76,27.53 arc(86.41,26.85) SW6.1
$2N4204: length 4
  Top Layer w0.203: R21.2 85.11,33.49 arc(86.51,32.91) SW5.1
$2N4207: length 6.9
  Top Layer w0.203: SW4.1 87.09,6.37 arc(85.83,9.4) R20.2
$2N4210: length 6.5
  Top Layer w0.203: R19.2 83.29,16.37 arc(85.98,15.26) SW3.1
$2N4330: length 6.1
  Top Layer w0.203: R23.2 83.9,22.08 arc(86.15,21.14) SW7.1
$2N4637: length 12.7
  Bottom Layer w0.203: 51.94,30.59 63.65,30.59 arc(64.09,30.41) v1(64.27,29.97)
$2N4791: length 13.7
  Top Layer w0.203: 67.31,43.31 69.78,43.31 arc(69.8,43.32) R31.2 ; R32.2 arc(66.9,44.21) 66.02,44.58 58.62,44.58 arc(57.82,44.24) H15.3
$2N5169: length 9.6
  Top Layer w0.203: R33.2 47.55,12.12 arc(47.06,11.92) 46.86,11.43 46.86,7.38 arc(47.61,5.59) 49.4,4.84
$2N5175: length 7.3
  Bottom Layer w0.203: 54.48,4.84 54.48,12.03 arc(54.45,12.09) v1(54.39,12.12)
$2N5181: length 6.9
  Top Layer w0.203: R35.1 arc(53.09,8.45) 53.09,8.44 53.09,3.69 arc(53.49,2.71) H17.5
$2N5187: length 8.3
  Top Layer w0.203: R34.2 48.14,7.36 arc(48.44,6.65) 49.15,6.35 49.53,6.35 arc(50.25,6.05) 50.55,5.33 50.55,3.45 arc(50.21,2.64) H17.1
$2N5421: length 3.3
  Top Layer w0.203: Q3.1 63.29,27.14 arc(63.98,26.85) R25.2
$2N14767: length 1.8
  Top Layer w0.203: R10.2 R9.1
$2N14896: length 20.9
  Top Layer w0.635: C12.2 28.24,22.28 arc(29.16,24.48) 31.37,25.4 ; U16.2 31.57,19.76 arc(32.14,21.14) 33.53,21.72 arc(34.87,22.27) 35.43,23.62 U21.1 arc(35.42,25.67) 35.41,25.68 U19.2
$2N15019: length 2.3
  Top Layer w0.203: U13.6 R13.2
$2N15192: length 14.1
  Top Layer w0.203: R10.1 R11.2 arc(34.47,13.65) 33.71,13.33 25.54,13.33 arc(24.73,13.67) 24.39,14.48 U13.5
$2N20242: length 2.2
  Top Layer w0.203: R37.2 LED4.2
$2N23857: length 8.9
  Bottom Layer w0.203: 52.07,25.59 57.08,25.59 arc(58.85,26.32) v1(59.58,28.09)
$2N28219: length 24.5
  Bottom Layer w0.203: H20.8 34.39,37.97 arc(35.07,39.63) 36.72,40.31 39.15,40.31 arc(40.56,40.9) 41.15,42.31 41.15,43.43 arc(41.52,44.33) 42.42,44.7 49.29,44.7 arc(51.43,45.59) H19.1
$2N28229: length 25
  Bottom Layer w0.203: H20.7 31.85,38.83 arc(32.47,40.34) 33.97,40.96 38.41,40.96 arc(39.72,41.5) 40.26,42.81 40.26,44.2 arc(40.67,45.18) 41.66,45.59 47.64,45.59 arc(49.16,46.22) H19.2
$2N28234: length 24.5
  Bottom Layer w0.203: H20.6 29.31,39.16 arc(29.96,40.73) 31.53,41.38 36.3,41.38 arc(38.74,42.39) 39.75,44.83 arc(40.16,45.82) 41.15,46.23 45.73,46.23 arc(46.8,46.67) H19.3
$2N28247: length 23.8
  Bottom Layer w0.203: H19.6 arc(37.92,43.62) 33.79,41.91 26.13,41.91 arc(22.99,40.61) H20.3
$2N28264: length 23.8
  Bottom Layer w0.203: H19.7 arc(35.54,44) 31.8,42.45 24.13,42.45 arc(20.61,40.99) H20.2
$2N28269: length 23.8
  Bottom Layer w0.203: H19.8 26.88,47.74 arc(19.62,44.73) H20.1

## Copper pours and planes (outline as drawn; the poured copper is in the pictures)
+5V on Inner1: 29.84,16.13 29.84,12.19 29.92,12.01 30.1,11.94 30.6,-0.62 30.47,-0.76 30.6,-0.89 96.27,-0.89 96.63,-0.74 96.77,-0.38 96.77,3.43 95.96,5.4 93.98,6.22 80.72,6.22 79.68,6.65 77.75,11.32 74.12,12.83 68.33,12.83 68.33,33.17 68.49,33.2 68.66,33.15 101.6,33.15 102.3,35.32 102.49,37.59 102.49,52.96 102.12,53.86 101.22,54.23 61.74,54.23 55.94,53.78 50.16,53.09 46.9,54.95 44.83,51.82 42.93,51.82 42.54,16.13
GND5V on Top Layer: 14.22,53.21 14.22,27.94 54.61,27.94 54.61,-2.41 101.6,-2.41 104.2,-1.33 105.28,1.27 105.28,53.21
GND5V on Inner2: -2.41,51.82 -2.23,52.27 -1.78,52.45 95.25,52.45 100.55,50.26 102.74,44.96 102.74,-0.89 102.11,-2.42 100.58,-3.05 -1.14,-3.05 -2.04,-2.68 -2.41,-1.78
GNDBAT on Top Layer: 13.46,56.13 13.46,27.43 50.93,27.43 50.93,7.11 53.34,7.11 53.34,-1.65 -6.6,-1.65 -6.6,56.13
GNDBAT on Bottom Layer: -34.54,40.26 -28.7,54.36 -14.61,60.2 111.76,60.2 124.42,54.95 129.67,42.29 129.67,7.49 122.38,-10.11 104.78,-17.4 3.05,-17.4 -23.53,-6.39 -34.54,20.19
VCCBAT on Top Layer: 0.8,35.18 13.08,35.18 13.08,18.29 0.8,18.29
$2N862 on Inner1: 5.72,47.5 12.19,47.5 12.19,36.32 5.72,36.32

Small or netless copper shapes (teardrops, artwork), in the pictures only: 159 on Top Layer, 72 on Bottom Layer, 7 on Inner1, 1 on Inner2

## Text on the board
Top Silkscreen Layer: TOF | G | V | OP | 5V | v | 电磁运放 | 编码器1 | 电机信号 | 霍尔 | 编码器2 | 姿态传感器 | 屏幕 | 无线串口 | 串口 | BST-磁驭 / 2024年6月 V1.0
